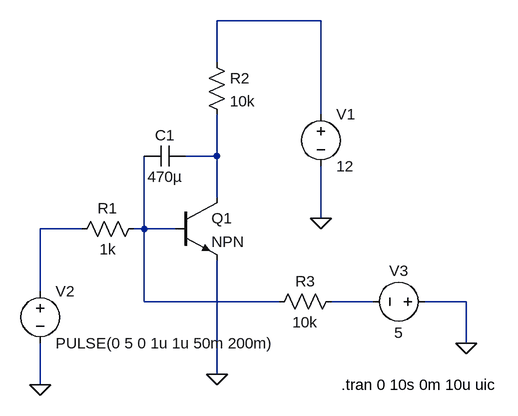
[diagram p0: schematic miller.asc]
miller.asc, the LTspice schematic file:
Version 4
SHEET 1 880 680
WIRE 384 -160 224 -160
WIRE 224 -96 224 -160
WIRE 384 -16 384 -160
WIRE 224 48 224 -16
WIRE 224 48 176 48
WIRE 224 112 224 48
WIRE 384 144 384 64
WIRE 16 160 -48 160
WIRE 112 160 112 48
WIRE 112 160 96 160
WIRE 160 160 112 160
WIRE -48 256 -48 160
WIRE 112 272 112 160
WIRE 320 272 112 272
WIRE 464 272 400 272
WIRE 608 272 544 272
WIRE 608 336 608 272
WIRE 224 384 224 208
WIRE -48 400 -48 336
FLAG 224 384 0
FLAG -48 400 0
FLAG 384 144 0
FLAG 608 336 0
SYMBOL npn 160 112 R0
SYMATTR InstName Q1
SYMBOL res 112 144 R90
WINDOW 0 0 56 VBottom 2
WINDOW 3 32 56 VTop 2
SYMATTR InstName R1
SYMATTR Value 1k
SYMBOL res 208 -112 R0
SYMATTR InstName R2
SYMATTR Value 10k
SYMBOL cap 176 32 R90
WINDOW 0 0 32 VBottom 2
WINDOW 3 32 32 VTop 2
SYMATTR InstName C1
SYMATTR Value 470µ
SYMBOL voltage 384 -32 R0
WINDOW 123 0 0 Left 2
WINDOW 39 0 0 Left 2
SYMATTR InstName V1
SYMATTR Value 12
SYMBOL voltage -48 240 R0
WINDOW 123 0 0 Left 2
WINDOW 39 0 0 Left 2
SYMATTR InstName V2
SYMATTR Value PULSE(0 5 0 1u 1u 50m 200m)
SYMBOL res 416 256 R90
WINDOW 0 0 56 VBottom 2
WINDOW 3 32 56 VTop 2
SYMATTR InstName R3
SYMATTR Value 10k
SYMBOL voltage 560 272 R90
WINDOW 0 -32 56 VBottom 2
WINDOW 3 32 56 VTop 2
WINDOW 123 0 0 Left 2
WINDOW 39 0 0 Left 2
SYMATTR InstName V3
SYMATTR Value 5
TEXT 416 400 Left 2 !.tran 0 10s 0m 10u uic

The netlist it stands for:
* miller.asc
Q1 N002 N004 0 0 NPN
R1 N004 N003 1k
R2 N001 N002 10k
C1 N002 N004 470µ
V1 N001 0 12
V2 N003 0 PULSE(0 5 0 1u 1u 50m 200m)
R3 N005 N004 10k
V3 0 N005 5
.model NPN NPN
.model PNP PNP
.lib standard.bjt
.tran 0 10s 0m 10u uic
.backanno
.end